# Altium schematic sheet micph.SchDoc
size A
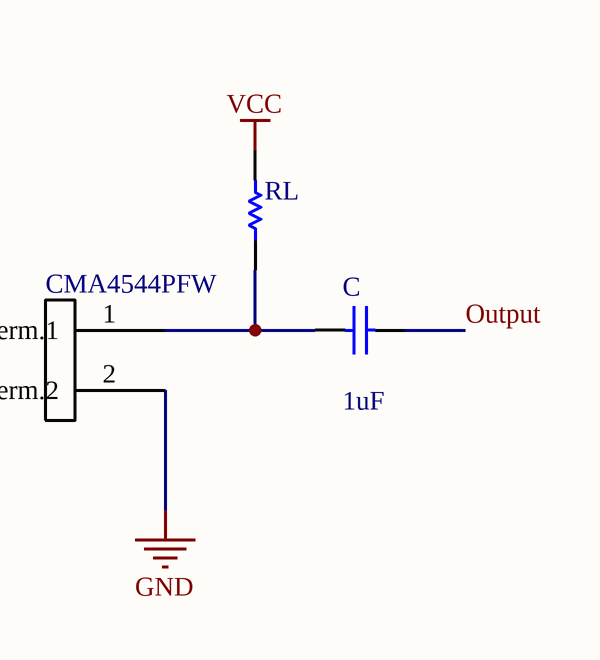
[diagram p0: micph.SchDoc]

## Parts
C  value 1uF  [RAD-0.3]
CMA4544PFW  (no value)
RL  (no value)  [AXIAL-0.3]

## Nets
GND: CMA4544PFW.2(Term.2)
VCC: RL.2
Output: C.2
NetC_1: C.1 CMA4544PFW.1(Term.1) RL.1

## Library data of the parts
C = Cap: Capacitor; Published: 8-Jun-2000; LatestRevisionDate: 17-Jul-2002; LatestRevisionNote: Re-released for DXP Platform.; PackageReference: RAD-0.3; Publisher: Altium Limited; PackageDescription: Radial Cap, Thru-Hole; 2 Leads; 0.3 in Pin Spacing
CMA4544PFW = Component_1
RL = Res1: Resistor; Published: 8-Jun-2000; LatestRevisionDate: 17-Jul-2002; LatestRevisionNote: Re-released for DXP Platform.; PackageReference: AXIAL-0.3; Publisher: Altium Limited; PackageDescription: Axial Device, Thru-Hole; 2 Leads; 0.3 in Pin Spacing